# EasyEDA Pro project ST-Link.epro

# Schematic ST-Link_v1_1
Board Name: ST-LINK_v1_1; Create Date: 2025-02-08; Page Name: ST-LINK; Project Name: ST-Link; Schematic Name: ST-LINK_v1_1; Update Date: 2025-02-09
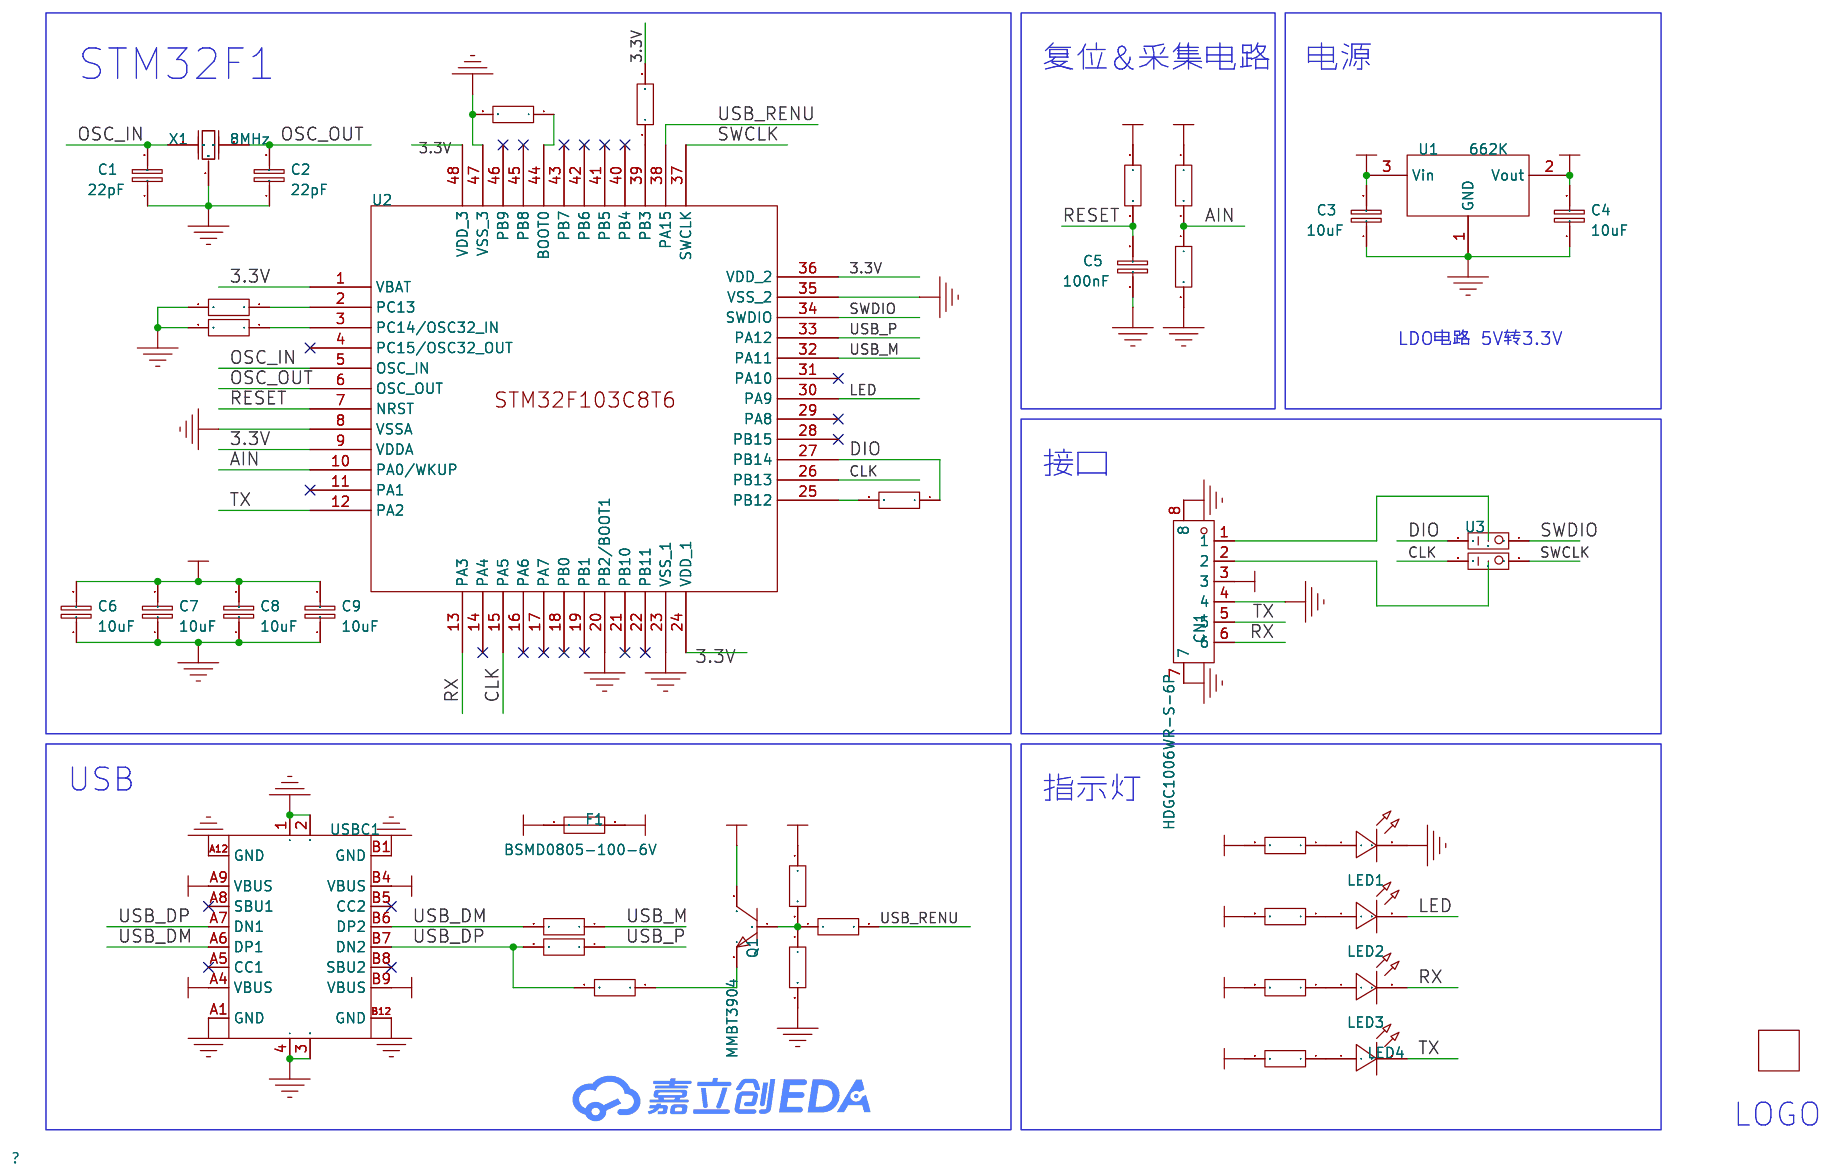
[diagram p0: schematic sheet]

## Parts
C1  22pF  [C0603]
C2  22pF  [C0603]
C3  10uF  [C0603]
C4  10uF  [C0603]
C5  100nF  [C0603]
C6  10uF  [C0603]
C7  10uF  [C0603]
C8  10uF  [C0603]
C9  10uF  [C0603]
CN1  HDGC1006WR-S-6P  [CONN-SMD_6P-P1.00_HDGC1006WR-S-6P]
F1  BSMD0805-100-6V  [F0805]
H1  MoonGrt  [MoonGrt]  (no BOM)
LED1  LTST-C193TBKT-5A  [LED0603]
LED2  LTST-C193TBKT-5A  [LED0603]
LED3  LTST-C193TBKT-5A  [LED0603]
LED4  LTST-C193TBKT-5A  [LED0603]
Q1  MMBT3904  [SOT-23-3_L2.9-W1.3-P1.90-LS2.4-BR]
R1  4.7kΩ  [R0603]
R2  10kΩ  [R0603]
R3  10kΩ  [R0603]
R4  10kΩ  [R0603]
R5  10kΩ  [R0603]
R6  10kΩ  [R0603]
R7  10kΩ  [R0603]
R8  100Ω  [R0603]
R9  1kΩ  [R0603]
R10  10kΩ  [R0603]
R11  22Ω  [R0603]
R12  22Ω  [R0603]
R13  100Ω  [R0603]
R14  1kΩ  [R0603]
R15  36kΩ  [R0603]
R16  1.5kΩ  [R0603]
R17  1kΩ  [R0603]
R18  1kΩ  [R0603]
U1  662K  [SOT-23-3_L2.9-W1.3-P1.90-LS2.4-BR]
U2  STM32F103C8T6  [LQFP-48_L7.0-W7.0-P0.50-LS9.0-BL]
U3  CAS-D20TB1  [SW-SMD_L5.4-W3.9_CAS-D20B]
USBC1  TYPE-C-31-M-12  [USB-C_SMD-TYPE-C-31-M-12]
X1  8MHz  [OSC-SMD_3P-L3.2-W1.3-P1.20-L]

## Library data of the parts
C1 C2 = CL10C220JB8NNNC: 容值:22pF;精度:±5%;额定电压:50V;材质(温度系数):C0G;; LCSC Part Name: 22pF ±5% 50V; Supplier Part: C1653; Manufacturer: SAMSUNG(三星); Supplier Footprint: 0603; JLCPCB Part Class: Basic Part; Datasheet: https://atta.szlcsc.com/upload/public/pdf/source/20160218/1457707763339.pdf; Supplier: LCSC; Tolerance: ±5%; Voltage Rated: 50V; Temperature Coefficient: C0G
C3 C4 C6-C9 = CL10A106KP8NNNC: 容值:10uF;精度:±10%;额定电压:10V;材质(温度系数):X5R;; LCSC Part Name: 10uF ±10% 10V; Supplier Part: C19702; Manufacturer: SAMSUNG(三星); Supplier Footprint: 0603; JLCPCB Part Class: Basic Part; Datasheet: https://atta.szlcsc.com/upload/public/pdf/source/20160218/1457707763339.pdf; Supplier: LCSC; Tolerance: ±10%; Voltage Rated: 10V; Temperature Coefficient: X5R
C5 = CC0603KRX7R9BB104: 容值:100nF;精度:±10%;额定电压:50V;材质(温度系数):X7R;; LCSC Part Name: 100nF ±10% 50V; Supplier Part: C14663; Manufacturer: YAGEO(国巨); Supplier Footprint: 0603; JLCPCB Part Class: Basic Part; Datasheet: https://atta.szlcsc.com/upload/public/pdf/source/20180910/C282072_33301C7F631E79921B82A8DAC6BCC5B3.pdf; Supplier: LCSC; Tolerance: ±10%; Voltage Rated: 50V; Temperature Coefficient: X7R
CN1 = HDGC1006WR-S-6P: 插针结构:1x6P;间距:1mm;安装方式:卧贴;总PIN数:6P;排数:1;每排PIN数:6;额定电流:1A;; LCSC Part Name: 1x6P 间距:1mm 卧贴; Supplier Part: C5197090; Manufacturer: HDGC(华德共创); Supplier Footprint: SMD,P=1mm; JLCPCB Part Class: Extended Part; Datasheet: https://atta.szlcsc.com/upload/public/pdf/source/20221012/30255957866F13431CB1BBD07128FF9E.pdf; Supplier: LCSC; Pins Structure: 1x6P; Pitch: 1mm; Mounting Style: 卧贴; Number of Pins: 6P; Number of Rows: 1; Number of PINs Per Row: 6; Current Rating (Max): 1A
F1 = BSMD0805-100-6V: 最大电压:6V;最大电流:40A;保持电流:1A;跳闸电流:2A;; LCSC Part Name: 6V 1A 0805自恢复; Supplier Part: C883112; Manufacturer: BHFUSE(佰宏); Supplier Footprint: 0805; JLCPCB Part Class: Extended Part; Datasheet: https://atta.szlcsc.com/upload/public/pdf/source/20230512/7A46D6CD923C15CBB98FD769C08EDD80.pdf; Supplier: LCSC; Operating Voltage (Max): 6V; Current Rating (Max): 40A; Hold Current: 1A; Trip Current: 2A; Power Dissipation: 600mW; Resistance - Initial (Ri) (Min): 40mΩ; Resistance - Post Trip (R1) (Max): 270mΩ; Maximum Time to Trip: 300ms; Operating Temperature: -40℃~+85℃
H1 = MoonGrt
LED1-LED4 = LTST-C193TBKT-5A: 发光颜色:蓝色;正向电压(VF):2.8V;功率:76mW;正向电流:5mA;主波长:465nm~475nm;二极管配置:-;透镜颜色:无色透明透镜;色温:-;发光强度:15mcd;发光角度:130°;载带方式:-;工作温度:-20℃~+80℃;; LCSC Part Name: 蓝灯; Supplier Part: C125103; Manufacturer: LITEON(光宝); Supplier Footprint: 0603; JLCPCB Part Class: Extended Part; Datasheet: https://atta.szlcsc.com/upload/public/pdf/source/20171230/C125103_15146280496221222053.pdf; Supplier: LCSC; Emitted Color: 蓝色; Forward Voltage (VF): 2.8V; Power Dissipation: 76mW; Forward Current: 5mA; Dominant Wavelength: 465nm~475nm; Peak Wavelength: 468nm; Lens Color: 无色透明透镜; Luminous Intensity: 15mcd; Viewing Angle: 130°; Operating Temperature: -20℃~+80℃
Q1 = MMBT3904_C7420353: 晶体管类型:NPN;集电极电流(Ic):200mA;集射极击穿电压(Vceo):40V;功率(Pd):200mW;直流电流增益(hFE@Ic,Vce):100@10mA,1.0V;; LCSC Part Name: hFE:200-300，丝印:1AM; Supplier Part: C7420353; Manufacturer: 宏迦橙; Supplier Footprint: SOT-23; JLCPCB Part Class: Extended Part; Datasheet: https://atta.szlcsc.com/upload/public/pdf/source/20231222/9A010B27D82CC750314EB13106235FB7.pdf; Supplier: LCSC; Transistor Type: NPN; Collector Current (Ic): 200mA; Collector-Emitter Breakdown Voltage (Vceo): 40V; Power Dissipation (Pd): 200mW; DC Current Gain (hFE@Ic,Vce): 100@10mA,1.0V; Transition Frequency (fT): 300MHz; Collector Cut-Off Current (Icbo): 100nA; Collector-Emitter Saturation Voltage (VCE(sat)@Ic,Ib): 300mV@50mA,5.0mA; Operating Temperature: -55℃~+150℃
R1 = 0603WAF4701T5E: 电阻类型:厚膜电阻;阻值:4.7kΩ;精度:±1%;功率:100mW;最大工作电压:75V;温度系数:±100ppm/℃;; LCSC Part Name: 4.7kΩ ±1% 100mW 厚膜电阻; Supplier Part: C23162; Manufacturer: UNI-ROYAL(厚声); Supplier Footprint: 0603; JLCPCB Part Class: Basic Part; Datasheet: https://atta.szlcsc.com/upload/public/pdf/source/20200306/C422600_1E6D84923E4A46A82E41ADD87F860B5C.pdf; Supplier: LCSC; Type: 厚膜电阻; Tolerance: ±1%; Power(Watts): 100mW; Overload Voltage (Max): 75V; Temperature Coefficient: ±100ppm/℃; Operating Temperature Range: -55℃~+155℃
R2-R7 R10 = 0603WAF1002T5E: 电阻类型:厚膜电阻;阻值:10kΩ;精度:±1%;功率:100mW;最大工作电压:75V;温度系数:±100ppm/℃;; LCSC Part Name: 厚膜电阻 10kΩ ±1% 100mW; Supplier Part: C25804; Manufacturer: UNI-ROYAL(厚声); Supplier Footprint: 0603; JLCPCB Part Class: Basic Part; Datasheet: https://atta.szlcsc.com/upload/public/pdf/source/20200306/C422600_1E6D84923E4A46A82E41ADD87F860B5C.pdf; Supplier: LCSC; Type: 厚膜电阻; Tolerance: ±1%; Power(Watts): 100mW; Overload Voltage (Max): 75V; Temperature Coefficient: ±100ppm/℃; Operating Temperature Range: -55℃~+155℃
R8 R13 = 0603WAF1000T5E: 电阻类型:厚膜电阻;阻值:100Ω;精度:±1%;功率:100mW;最大工作电压:75V;温度系数:±200ppm/℃;; LCSC Part Name: 100Ω ±1% 100mW 厚膜电阻; Supplier Part: C22775; Manufacturer: UNI-ROYAL(厚声); Supplier Footprint: 0603; JLCPCB Part Class: Basic Part; Datasheet: https://atta.szlcsc.com/upload/public/pdf/source/20200306/C422600_1E6D84923E4A46A82E41ADD87F860B5C.pdf; Supplier: LCSC; Type: 厚膜电阻; Tolerance: ±1%; Power(Watts): 100mW; Overload Voltage (Max): 75V; Temperature Coefficient: ±200ppm/℃; Operating Temperature Range: -55℃~+155℃
R9 R14 R17 R18 = 0603WAF1001T5E: 电阻类型:厚膜电阻;阻值:1kΩ;精度:±1%;功率:100mW;最大工作电压:75V;温度系数:±100ppm/℃;; LCSC Part Name: 1kΩ ±1% 100mW 厚膜电阻; Supplier Part: C21190; Manufacturer: UNI-ROYAL(厚声); Supplier Footprint: 0603; JLCPCB Part Class: Basic Part; Datasheet: https://atta.szlcsc.com/upload/public/pdf/source/20200306/C422600_1E6D84923E4A46A82E41ADD87F860B5C.pdf; Supplier: LCSC; Type: 厚膜电阻; Tolerance: ±1%; Power(Watts): 100mW; Overload Voltage (Max): 75V; Temperature Coefficient: ±100ppm/℃; Operating Temperature Range: -55℃~+155℃
R11 R12 = 0603WAF220JT5E: 电阻类型:厚膜电阻;阻值:22Ω;精度:±1%;功率:100mW;最大工作电压:75V;温度系数:±100ppm/℃;; LCSC Part Name: 22Ω ±1% 100mW 厚膜电阻; Supplier Part: C23345; Manufacturer: UNI-ROYAL(厚声); Supplier Footprint: 0603; JLCPCB Part Class: Basic Part; Datasheet: https://atta.szlcsc.com/upload/public/pdf/source/20200306/C422600_1E6D84923E4A46A82E41ADD87F860B5C.pdf; Supplier: LCSC; Type: 厚膜电阻; Tolerance: ±1%; Power(Watts): 100mW; Overload Voltage (Max): 75V; Temperature Coefficient: ±100ppm/℃; Operating Temperature Range: -55℃~+155℃
R15 = 0603WAF3602T5E: 电阻类型:厚膜电阻;阻值:36kΩ;精度:±1%;功率:100mW;最大工作电压:75V;温度系数:±100ppm/℃;; LCSC Part Name: 36kΩ ±1% 100mW 厚膜电阻; Supplier Part: C23147; Manufacturer: UNI-ROYAL(厚声); Supplier Footprint: 0603; JLCPCB Part Class: Extended Part; Datasheet: https://atta.szlcsc.com/upload/public/pdf/source/20200306/C422600_1E6D84923E4A46A82E41ADD87F860B5C.pdf; Supplier: LCSC; Type: 厚膜电阻; Tolerance: ±1%; Power(Watts): 100mW; Overload Voltage (Max): 75V; Temperature Coefficient: ±100ppm/℃; Operating Temperature Range: -55℃~+155℃
R16 = 0603WAF1501T5E: 电阻类型:厚膜电阻;阻值:1.5kΩ;精度:±1%;功率:100mW;最大工作电压:75V;温度系数:±100ppm/℃;; LCSC Part Name: 1.5kΩ ±1% 100mW 厚膜电阻; Supplier Part: C22843; Manufacturer: UNI-ROYAL(厚声); Supplier Footprint: 0603; JLCPCB Part Class: Basic Part; Datasheet: https://atta.szlcsc.com/upload/public/pdf/source/20200306/C422600_1E6D84923E4A46A82E41ADD87F860B5C.pdf; Supplier: LCSC; Type: 厚膜电阻; Tolerance: ±1%; Power(Watts): 100mW; Overload Voltage (Max): 75V; Temperature Coefficient: ±100ppm/℃; Operating Temperature Range: -55℃~+155℃
U1 = 662K: 输出类型:固定;最大输入电压:8V;输出电压:3.3V;最大输出电流:300mA;输出极性:正极;; LCSC Part Name: 662K. 输入8V 300mA; Supplier Part: C7470756; Manufacturer: HXY MOSFET(华轩阳电子); Supplier Footprint: SOT-23; JLCPCB Part Class: Extended Part; Datasheet: https://atta.szlcsc.com/upload/public/pdf/source/20230915/BA72989D17401E2852D389BF12EDF43F.pdf; Supplier: LCSC; Output Type: 固定; Maximum Input Voltage: 8V; Output Voltage: 3.3V; MAX Output Current: 300mA; Output Polarity: 正极; Number of Outputs: 1; Design Item ID: LM317; Library Name: fly
U2 = STM32F103C8T6: CPU内核:ARM-M3;CPU最大主频:72MHz;应用领域:-;; LCSC Part Name: 主流增强型ARM Cortex-M3 MCU，具有64 KB Flash、72 MHz CPU、电机控制、USB和CAN; Supplier Part: C8734; Manufacturer: ST(意法半导体); Supplier Footprint: LQFP-48(7x7); JLCPCB Part Class: Extended Part; Datasheet: https://atta.szlcsc.com/upload/public/pdf/source/20220812/8363ACEC51AD55ECEB84799464F7CB85.pdf; Supplier: LCSC; CPU Core: ARM-M3; CPU Maximum Speed: 72MHz; Program Storage Size: 64KB; Program Memory Type: FLASH; Number of I/O: 37; ADC (Bit): 12bit; Low Voltage Detection Threshold: 2V~3.6V
U3 = CAS-D20TB1: 电路结构:单刀双掷;安装方式:立贴;开关颜色:白色;额定电流(DC):100mA;额定电压(DC):50V;机械寿命:-;; LCSC Part Name: 立贴两档 滑动开关; Supplier Part: C2921545; Manufacturer: NIDEC(尼得科); Supplier Footprint: SMD; JLCPCB Part Class: 扩展库; Datasheet: https://atta.szlcsc.com/upload/public/pdf/source/20220330/71F3735FCF2D747C582FB0D70EB9BF68.pdf; Supplier: LCSC; Circuit: 单刀双掷; Pin Style: 鸥翼型; Switch Length: 5.4mm; Switch Width: 3.9mm; Switch Height: 2.5mm; Mounting Style: 立贴; Actuator Color: 白色; Current Rating (DC): 100mA; Voltage Rating (DC): 50V; Operating Temperature: -40℃~+85℃
USBC1 = TYPE-C-31-M-12: 连接器类型:Type-C;标准:-;公母:母;安装方式:-;触点数量:16P;端口数量:1;额定电流 - 电源:5A;工作温度范围:-;; LCSC Part Name: Type-C 母; Supplier Part: C165948; Manufacturer: 韩国韩荣; Supplier Footprint: SMD; JLCPCB Part Class: Extended Part; Datasheet: https://atta.szlcsc.com/upload/public/pdf/source/20220525/466408E853115E789EDB0DDC29077C05.pdf; Supplier: LCSC; Connector Type: Type-C; Gender: 母; Number of Contacts: 16P; Number of Ports: 1; Current Rating - Power (Max): 5A
X1 = CSTNE8M00GH5C000R0: 频率:8MHz;内置负载电容:33pF;谐振阻抗:40Ω;; LCSC Part Name: 8MHz ±0.07% 内置负载电容:33pF; Supplier Part: C341525; Manufacturer: muRata(村田); Supplier Footprint: SMD3213-3P; JLCPCB Part Class: Extended Part; Datasheet: https://atta.szlcsc.com/upload/public/pdf/source/20181211/C341525_832BA077079E4863A5153C1DB98581D5.pdf; Supplier: LCSC; Built-in Load Capacitance: 33pF; Resonant Impedance: 40Ω; Operating Temperature: -40℃~+125℃

## Nets
3.3V: C4.2 C6.2 C7.2 C8.2 C9.2 CN1.3 Q1.3(C) R1.2 R3.1 R4.1 R9.2 R14.2 R17.2 R18.2 U1.2(Vout) U2.1(VBAT) U2.9(VDDA) U2.24(VDD_1) U2.36(VDD_2) U2.48(VDD_3)
5V: C3.2 F1.2 R10.1 U1.3(Vin)
GND: C1.1 C2.1 C3.1 C4.1 C5.1 C6.1 C7.1 C8.1 C9.1 CN1.4 CN1.7 CN1.8 LED1.2 R2.2 R5.2 R6.2 R7.2 R15.2 U1.1(GND) U2.8(VSSA) U2.20(PB2/BOOT1) U2.23(VSS_1) U2.35(VSS_2) U2.47(VSS_3) USBC1.1 USBC1.2 USBC1.3 USBC1.4 USBC1.A1(GND) USBC1.A12(GND) USBC1.B1(GND) USBC1.B12(GND) X1.2(GND)
VBUS: F1.1 USBC1.A4(VBUS) USBC1.A9(VBUS) USBC1.B4(VBUS) USBC1.B9(VBUS)
AIN: R4.2 R5.1 U2.10(PA0/WKUP)
CLK: U2.15(PA5) U2.26(PB13) U3.3
DIO: R8.1 U2.27(PB14) U3.6
LED: LED2.2 U2.30(PA9)
OSC_IN: C1.2 U2.5(OSC_IN) X1.3(OSC2)
OSC_OUT: C2.2 U2.6(OSC_OUT) X1.1(OSC1)
RESET: C5.2 R3.2 U2.7(NRST)
RX: CN1.6 LED3.2 U2.13(PA3)
SWCLK: U2.37(SWCLK) U3.1
SWDIO: U2.34(SWDIO) U3.4
TX: CN1.5 LED4.2 U2.12(PA2)
USB_DM: R11.2 USBC1.A6(DP1) USBC1.B6(DP2)
USB_DP: R12.2 R16.2 USBC1.A7(DN1) USBC1.B7(DN2)
USB_M: R11.1 U2.32(PA11)
USB_P: R12.1 U2.33(PA12)
USB_RENU: R13.2 U2.38(PA15)
$2N32655: R6.1 U2.2(PC13)
$2N32685: Q1.2(E) R16.1
$2N32778: R8.2 U2.25(PB12)
$2N32789: CN1.2 U3.2
$2N32791: CN1.1 U3.5
$2N32800: R2.1 U2.44(BOOT0)
$2N32802: R1.1 U2.39(PB3)
$2N32803: R7.1 U2.3(PC14/OSC32_IN)
$2N32831: Q1.1(B) R10.2 R13.1 R15.1
$2N38015: LED1.1 R9.1
$2N38044: LED2.1 R14.1
$2N38073: LED3.1 R17.1
$2N38102: LED4.1 R18.1

Not connected (* = marked no-connect by the designer): U2 4(PC15/OSC32_OUT)* 11(PA1)* 14(PA4)* 16(PA6)* 17(PA7)* 18(PB0)* 19(PB1)* 21(PB10)* 22(PB11)* 28(PB15)* 29(PA8)* 31(PA10)* 40(PB4)* 41(PB5)* 42(PB6)* 43(PB7)* 45(PB8)* 46(PB9)*; USBC1 A5(CC1)* A8(SBU1)* B5(CC2)* B8(SBU2)*

## Notes on the sheet
- STM32F1
- 复位&采集电路
- 电源
- LDO电路 5V转3.3V
- 接口
- USB
- 指示灯
- LOGO

# Schematic ST-Link_v1_2
Board Name: ST-Link_v1_2; Create Date: 2025-02-18; Page Name: ST-Link; Project Name: ST-Link; Schematic Name: ST-Link_1; Update Date: 2025-02-18
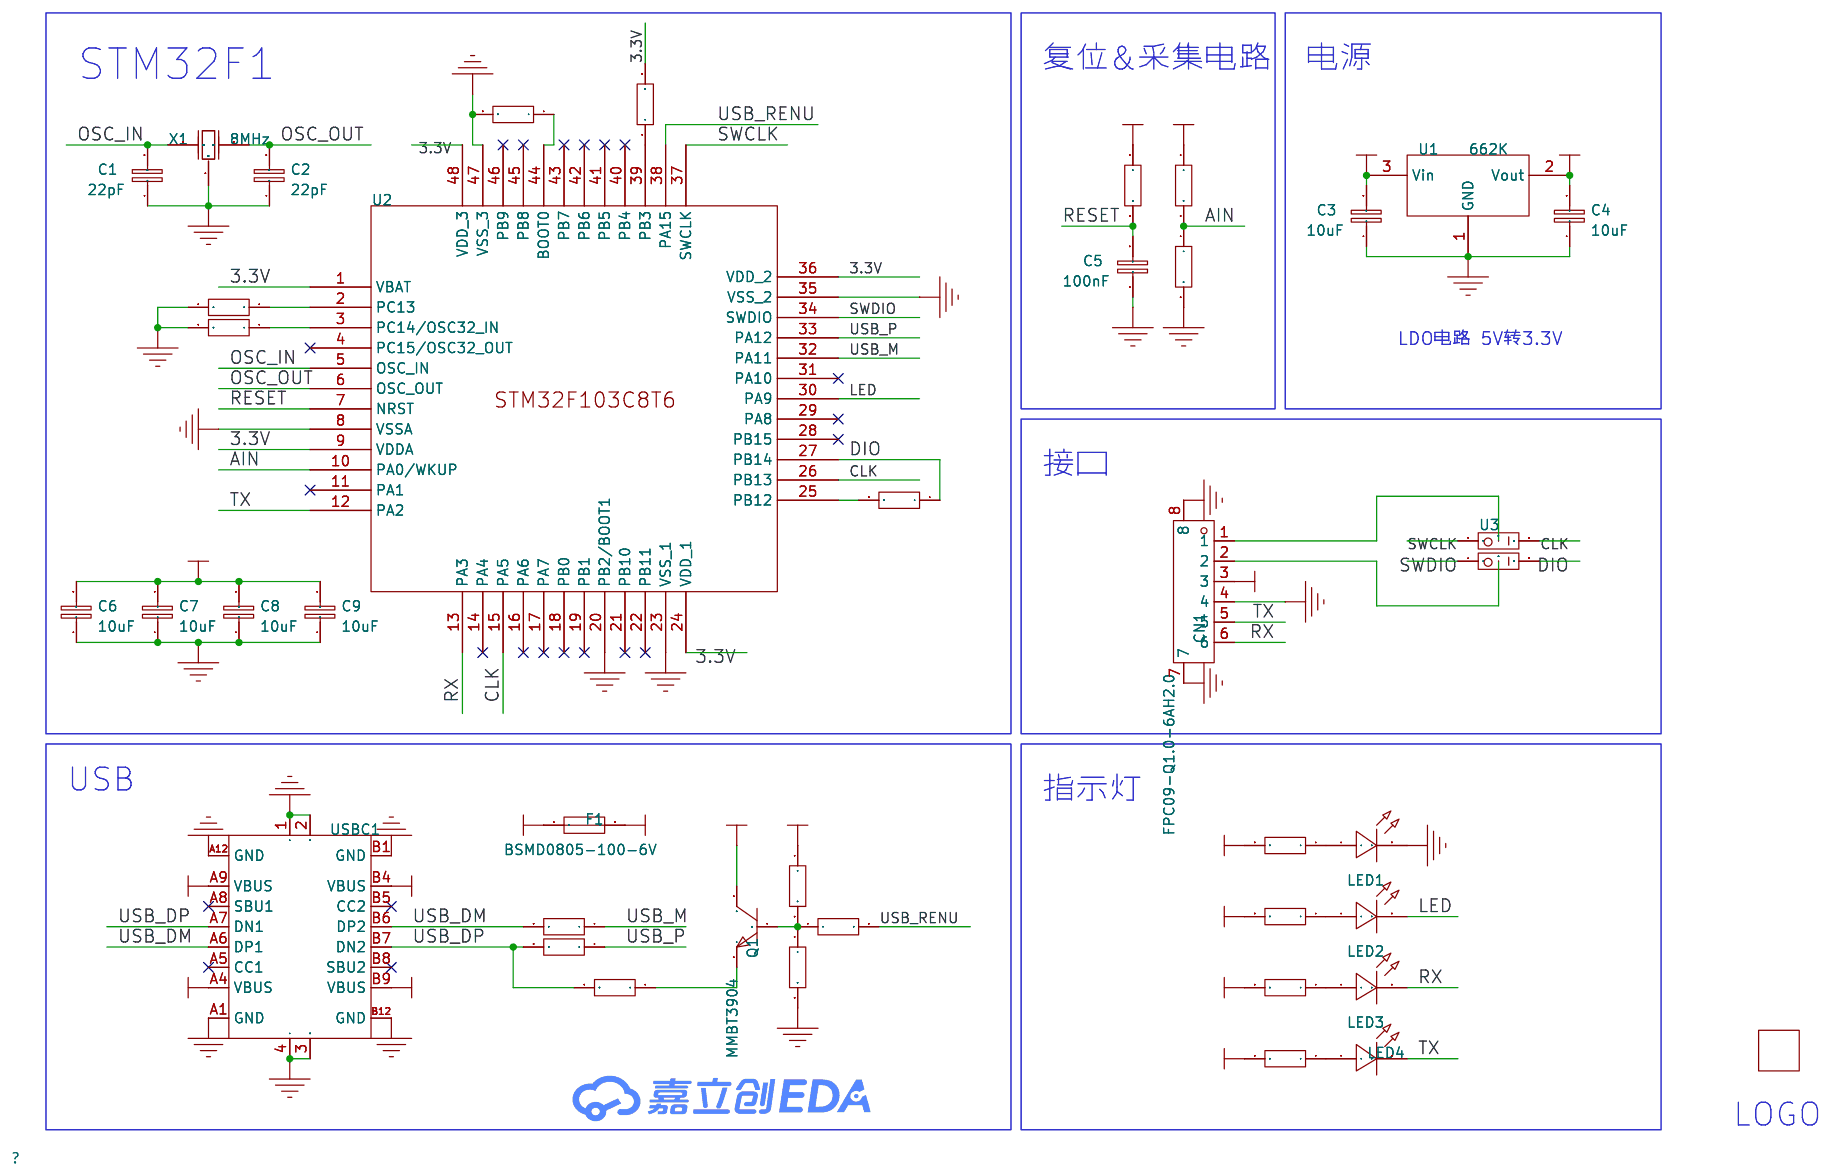
[diagram p1: schematic sheet]

## Parts
C1  22pF  [C0603]
C2  22pF  [C0603]
C3  10uF  [C0603]
C4  10uF  [C0603]
C5  100nF  [C0603]
C6  10uF  [C0603]
C7  10uF  [C0603]
C8  10uF  [C0603]
C9  10uF  [C0603]
CN1  FPC09-Q1.0-6AH2.0  [FPC-SMD_6P-P1.00_XYECONN_FPC09-Q1.0-6AH2.0]
F1  BSMD0805-100-6V  [F0805]
H1  MoonGrt  [MoonGrt]  (no BOM)
LED1  LTST-C193TBKT-5A  [LED0603]
LED2  LTST-C193TBKT-5A  [LED0603]
LED3  LTST-C193TBKT-5A  [LED0603]
LED4  LTST-C193TBKT-5A  [LED0603]
Q1  MMBT3904  [SOT-23-3_L2.9-W1.3-P1.90-LS2.4-BR]
R1  4.7kΩ  [R0603]
R2  10kΩ  [R0603]
R3  10kΩ  [R0603]
R4  10kΩ  [R0603]
R5  10kΩ  [R0603]
R6  10kΩ  [R0603]
R7  10kΩ  [R0603]
R8  100Ω  [R0603]
R9  1kΩ  [R0603]
R10  10kΩ  [R0603]
R11  22Ω  [R0603]
R12  22Ω  [R0603]
R13  100Ω  [R0603]
R14  1kΩ  [R0603]
R15  36kΩ  [R0603]
R16  1.5kΩ  [R0603]
R17  1kΩ  [R0603]
R18  1kΩ  [R0603]
U1  662K  [SOT-23-3_L2.9-W1.3-P1.90-LS2.4-BR]
U2  STM32F103C8T6  [LQFP-48_L7.0-W7.0-P0.50-LS9.0-BL]
U3  CAS-D20TB1  [SW-SMD_L5.4-W3.9_CAS-D20B]
USBC1  TYPE-C-31-M-12  [USB-C_SMD-TYPE-C-31-M-12]
X1  8MHz  [OSC-SMD_3P-L3.2-W1.3-P1.20-L]

## Library data of the parts
C1 C2 = CL10C220JB8NNNC: 容值:22pF;精度:±5%;额定电压:50V;材质(温度系数):C0G;; LCSC Part Name: 22pF ±5% 50V; Supplier Part: C1653; Manufacturer: SAMSUNG(三星); Supplier Footprint: 0603; JLCPCB Part Class: Basic Part; Datasheet: https://atta.szlcsc.com/upload/public/pdf/source/20160218/1457707763339.pdf; Supplier: LCSC; Tolerance: ±5%; Voltage Rated: 50V; Temperature Coefficient: C0G
C3 C4 C6-C9 = CL10A106KP8NNNC: 容值:10uF;精度:±10%;额定电压:10V;材质(温度系数):X5R;; LCSC Part Name: 10uF ±10% 10V; Supplier Part: C19702; Manufacturer: SAMSUNG(三星); Supplier Footprint: 0603; JLCPCB Part Class: Basic Part; Datasheet: https://atta.szlcsc.com/upload/public/pdf/source/20160218/1457707763339.pdf; Supplier: LCSC; Tolerance: ±10%; Voltage Rated: 10V; Temperature Coefficient: X5R
C5 = CC0603KRX7R9BB104: 容值:100nF;精度:±10%;额定电压:50V;材质(温度系数):X7R;; LCSC Part Name: 100nF ±10% 50V; Supplier Part: C14663; Manufacturer: YAGEO(国巨); Supplier Footprint: 0603; JLCPCB Part Class: Basic Part; Datasheet: https://atta.szlcsc.com/upload/public/pdf/source/20180910/C282072_33301C7F631E79921B82A8DAC6BCC5B3.pdf; Supplier: LCSC; Tolerance: ±10%; Voltage Rated: 50V; Temperature Coefficient: X7R
CN1 = FPC09-Q1.0-6AH2.0: 锁定特性:翻盖式;触点类型:下接;触点数量:6P;间距:1mm;安装类型:卧贴;; LCSC Part Name: 间距:1mm P数:6P 翻盖式 下接; Supplier Part: C19269921; Manufacturer: XYECONN(辛译); Supplier Footprint: SMD,P=1mm,卧贴; JLCPCB Part Class: Extended Part; Datasheet: https://atta.szlcsc.com/upload/public/pdf/source/20231122/290E50ABEF878A57FE1C34FD27D651A8.pdf; Supplier: LCSC; Locking Feature: 翻盖式; Contact Type: 下接; Number of Contacts: 6P; Pitch: 1mm; Mounting Type: 卧贴; Height Above Board: 2mm
F1 = BSMD0805-100-6V: 最大电压:6V;最大电流:40A;保持电流:1A;跳闸电流:2A;; LCSC Part Name: 6V 1A 0805自恢复; Supplier Part: C883112; Manufacturer: BHFUSE(佰宏); Supplier Footprint: 0805; JLCPCB Part Class: Extended Part; Datasheet: https://atta.szlcsc.com/upload/public/pdf/source/20230512/7A46D6CD923C15CBB98FD769C08EDD80.pdf; Supplier: LCSC; Operating Voltage (Max): 6V; Current Rating (Max): 40A; Hold Current: 1A; Trip Current: 2A; Power Dissipation: 600mW; Resistance - Initial (Ri) (Min): 40mΩ; Resistance - Post Trip (R1) (Max): 270mΩ; Maximum Time to Trip: 300ms; Operating Temperature: -40℃~+85℃
H1 = MoonGrt
LED1-LED4 = LTST-C193TBKT-5A: 发光颜色:蓝色;正向电压(VF):2.8V;功率:76mW;正向电流:5mA;主波长:465nm~475nm;二极管配置:-;透镜颜色:无色透明透镜;色温:-;发光强度:15mcd;发光角度:130°;载带方式:-;工作温度:-20℃~+80℃;; LCSC Part Name: 蓝灯; Supplier Part: C125103; Manufacturer: LITEON(光宝); Supplier Footprint: 0603; JLCPCB Part Class: Extended Part; Datasheet: https://atta.szlcsc.com/upload/public/pdf/source/20171230/C125103_15146280496221222053.pdf; Supplier: LCSC; Emitted Color: 蓝色; Forward Voltage (VF): 2.8V; Power Dissipation: 76mW; Forward Current: 5mA; Dominant Wavelength: 465nm~475nm; Peak Wavelength: 468nm; Lens Color: 无色透明透镜; Luminous Intensity: 15mcd; Viewing Angle: 130°; Operating Temperature: -20℃~+80℃
Q1 = MMBT3904_C7420353: 晶体管类型:NPN;集电极电流(Ic):200mA;集射极击穿电压(Vceo):40V;功率(Pd):200mW;直流电流增益(hFE@Ic,Vce):100@10mA,1.0V;; LCSC Part Name: hFE:200-300，丝印:1AM; Supplier Part: C7420353; Manufacturer: 宏迦橙; Supplier Footprint: SOT-23; JLCPCB Part Class: Extended Part; Datasheet: https://atta.szlcsc.com/upload/public/pdf/source/20231222/9A010B27D82CC750314EB13106235FB7.pdf; Supplier: LCSC; Transistor Type: NPN; Collector Current (Ic): 200mA; Collector-Emitter Breakdown Voltage (Vceo): 40V; Power Dissipation (Pd): 200mW; DC Current Gain (hFE@Ic,Vce): 100@10mA,1.0V; Transition Frequency (fT): 300MHz; Collector Cut-Off Current (Icbo): 100nA; Collector-Emitter Saturation Voltage (VCE(sat)@Ic,Ib): 300mV@50mA,5.0mA; Operating Temperature: -55℃~+150℃
R1 = 0603WAF4701T5E: 电阻类型:厚膜电阻;阻值:4.7kΩ;精度:±1%;功率:100mW;最大工作电压:75V;温度系数:±100ppm/℃;; LCSC Part Name: 4.7kΩ ±1% 100mW 厚膜电阻; Supplier Part: C23162; Manufacturer: UNI-ROYAL(厚声); Supplier Footprint: 0603; JLCPCB Part Class: Basic Part; Datasheet: https://atta.szlcsc.com/upload/public/pdf/source/20200306/C422600_1E6D84923E4A46A82E41ADD87F860B5C.pdf; Supplier: LCSC; Type: 厚膜电阻; Tolerance: ±1%; Power(Watts): 100mW; Overload Voltage (Max): 75V; Temperature Coefficient: ±100ppm/℃; Operating Temperature Range: -55℃~+155℃
R2-R7 R10 = 0603WAF1002T5E: 电阻类型:厚膜电阻;阻值:10kΩ;精度:±1%;功率:100mW;最大工作电压:75V;温度系数:±100ppm/℃;; LCSC Part Name: 厚膜电阻 10kΩ ±1% 100mW; Supplier Part: C25804; Manufacturer: UNI-ROYAL(厚声); Supplier Footprint: 0603; JLCPCB Part Class: Basic Part; Datasheet: https://atta.szlcsc.com/upload/public/pdf/source/20200306/C422600_1E6D84923E4A46A82E41ADD87F860B5C.pdf; Supplier: LCSC; Type: 厚膜电阻; Tolerance: ±1%; Power(Watts): 100mW; Overload Voltage (Max): 75V; Temperature Coefficient: ±100ppm/℃; Operating Temperature Range: -55℃~+155℃
R8 R13 = 0603WAF1000T5E: 电阻类型:厚膜电阻;阻值:100Ω;精度:±1%;功率:100mW;最大工作电压:75V;温度系数:±200ppm/℃;; LCSC Part Name: 100Ω ±1% 100mW 厚膜电阻; Supplier Part: C22775; Manufacturer: UNI-ROYAL(厚声); Supplier Footprint: 0603; JLCPCB Part Class: Basic Part; Datasheet: https://atta.szlcsc.com/upload/public/pdf/source/20200306/C422600_1E6D84923E4A46A82E41ADD87F860B5C.pdf; Supplier: LCSC; Type: 厚膜电阻; Tolerance: ±1%; Power(Watts): 100mW; Overload Voltage (Max): 75V; Temperature Coefficient: ±200ppm/℃; Operating Temperature Range: -55℃~+155℃
R9 R14 R17 R18 = 0603WAF1001T5E: 电阻类型:厚膜电阻;阻值:1kΩ;精度:±1%;功率:100mW;最大工作电压:75V;温度系数:±100ppm/℃;; LCSC Part Name: 1kΩ ±1% 100mW 厚膜电阻; Supplier Part: C21190; Manufacturer: UNI-ROYAL(厚声); Supplier Footprint: 0603; JLCPCB Part Class: Basic Part; Datasheet: https://atta.szlcsc.com/upload/public/pdf/source/20200306/C422600_1E6D84923E4A46A82E41ADD87F860B5C.pdf; Supplier: LCSC; Type: 厚膜电阻; Tolerance: ±1%; Power(Watts): 100mW; Overload Voltage (Max): 75V; Temperature Coefficient: ±100ppm/℃; Operating Temperature Range: -55℃~+155℃
R11 R12 = 0603WAF220JT5E: 电阻类型:厚膜电阻;阻值:22Ω;精度:±1%;功率:100mW;最大工作电压:75V;温度系数:±100ppm/℃;; LCSC Part Name: 22Ω ±1% 100mW 厚膜电阻; Supplier Part: C23345; Manufacturer: UNI-ROYAL(厚声); Supplier Footprint: 0603; JLCPCB Part Class: Basic Part; Datasheet: https://atta.szlcsc.com/upload/public/pdf/source/20200306/C422600_1E6D84923E4A46A82E41ADD87F860B5C.pdf; Supplier: LCSC; Type: 厚膜电阻; Tolerance: ±1%; Power(Watts): 100mW; Overload Voltage (Max): 75V; Temperature Coefficient: ±100ppm/℃; Operating Temperature Range: -55℃~+155℃
R15 = 0603WAF3602T5E: 电阻类型:厚膜电阻;阻值:36kΩ;精度:±1%;功率:100mW;最大工作电压:75V;温度系数:±100ppm/℃;; LCSC Part Name: 36kΩ ±1% 100mW 厚膜电阻; Supplier Part: C23147; Manufacturer: UNI-ROYAL(厚声); Supplier Footprint: 0603; JLCPCB Part Class: Extended Part; Datasheet: https://atta.szlcsc.com/upload/public/pdf/source/20200306/C422600_1E6D84923E4A46A82E41ADD87F860B5C.pdf; Supplier: LCSC; Type: 厚膜电阻; Tolerance: ±1%; Power(Watts): 100mW; Overload Voltage (Max): 75V; Temperature Coefficient: ±100ppm/℃; Operating Temperature Range: -55℃~+155℃
R16 = 0603WAF1501T5E: 电阻类型:厚膜电阻;阻值:1.5kΩ;精度:±1%;功率:100mW;最大工作电压:75V;温度系数:±100ppm/℃;; LCSC Part Name: 1.5kΩ ±1% 100mW 厚膜电阻; Supplier Part: C22843; Manufacturer: UNI-ROYAL(厚声); Supplier Footprint: 0603; JLCPCB Part Class: Basic Part; Datasheet: https://atta.szlcsc.com/upload/public/pdf/source/20200306/C422600_1E6D84923E4A46A82E41ADD87F860B5C.pdf; Supplier: LCSC; Type: 厚膜电阻; Tolerance: ±1%; Power(Watts): 100mW; Overload Voltage (Max): 75V; Temperature Coefficient: ±100ppm/℃; Operating Temperature Range: -55℃~+155℃
U1 = 662K: 输出类型:固定;最大输入电压:8V;输出电压:3.3V;最大输出电流:300mA;输出极性:正极;; LCSC Part Name: 662K. 输入8V 300mA; Supplier Part: C7470756; Manufacturer: HXY MOSFET(华轩阳电子); Supplier Footprint: SOT-23; JLCPCB Part Class: Extended Part; Datasheet: https://atta.szlcsc.com/upload/public/pdf/source/20230915/BA72989D17401E2852D389BF12EDF43F.pdf; Supplier: LCSC; Output Type: 固定; Maximum Input Voltage: 8V; Output Voltage: 3.3V; MAX Output Current: 300mA; Output Polarity: 正极; Number of Outputs: 1; Design Item ID: LM317; Library Name: fly
U2 = STM32F103C8T6: CPU内核:ARM-M3;CPU最大主频:72MHz;应用领域:-;; LCSC Part Name: 主流增强型ARM Cortex-M3 MCU，具有64 KB Flash、72 MHz CPU、电机控制、USB和CAN; Supplier Part: C8734; Manufacturer: ST(意法半导体); Supplier Footprint: LQFP-48(7x7); JLCPCB Part Class: Extended Part; Datasheet: https://atta.szlcsc.com/upload/public/pdf/source/20220812/8363ACEC51AD55ECEB84799464F7CB85.pdf; Supplier: LCSC; CPU Core: ARM-M3; CPU Maximum Speed: 72MHz; Program Storage Size: 64KB; Program Memory Type: FLASH; Number of I/O: 37; ADC (Bit): 12bit; Low Voltage Detection Threshold: 2V~3.6V
U3 = CAS-D20TB1: 电路结构:单刀双掷;安装方式:立贴;开关颜色:白色;额定电流(DC):100mA;额定电压(DC):50V;机械寿命:-;; LCSC Part Name: 立贴两档 滑动开关; Supplier Part: C2921545; Manufacturer: NIDEC(尼得科); Supplier Footprint: SMD; JLCPCB Part Class: 扩展库; Datasheet: https://atta.szlcsc.com/upload/public/pdf/source/20220330/71F3735FCF2D747C582FB0D70EB9BF68.pdf; Supplier: LCSC; Circuit: 单刀双掷; Pin Style: 鸥翼型; Switch Length: 5.4mm; Switch Width: 3.9mm; Switch Height: 2.5mm; Mounting Style: 立贴; Actuator Color: 白色; Current Rating (DC): 100mA; Voltage Rating (DC): 50V; Operating Temperature: -40℃~+85℃
USBC1 = TYPE-C-31-M-12: 连接器类型:Type-C;标准:-;公母:母;安装方式:-;触点数量:16P;端口数量:1;额定电流 - 电源:5A;工作温度范围:-;; LCSC Part Name: Type-C 母; Supplier Part: C165948; Manufacturer: 韩国韩荣; Supplier Footprint: SMD; JLCPCB Part Class: Extended Part; Datasheet: https://atta.szlcsc.com/upload/public/pdf/source/20220525/466408E853115E789EDB0DDC29077C05.pdf; Supplier: LCSC; Connector Type: Type-C; Gender: 母; Number of Contacts: 16P; Number of Ports: 1; Current Rating - Power (Max): 5A
X1 = CSTNE8M00GH5C000R0: 频率:8MHz;内置负载电容:33pF;谐振阻抗:40Ω;; LCSC Part Name: 8MHz ±0.07% 内置负载电容:33pF; Supplier Part: C341525; Manufacturer: muRata(村田); Supplier Footprint: SMD3213-3P; JLCPCB Part Class: Extended Part; Datasheet: https://atta.szlcsc.com/upload/public/pdf/source/20181211/C341525_832BA077079E4863A5153C1DB98581D5.pdf; Supplier: LCSC; Built-in Load Capacitance: 33pF; Resonant Impedance: 40Ω; Operating Temperature: -40℃~+125℃

## Nets
3.3V: C4.2 C6.2 C7.2 C8.2 C9.2 CN1.3 Q1.3(C) R1.2 R3.1 R4.1 R9.2 R14.2 R17.2 R18.2 U1.2(Vout) U2.1(VBAT) U2.9(VDDA) U2.24(VDD_1) U2.36(VDD_2) U2.48(VDD_3)
5V: C3.2 F1.2 R10.1 U1.3(Vin)
GND: C1.1 C2.1 C3.1 C4.1 C5.1 C6.1 C7.1 C8.1 C9.1 CN1.4 CN1.7 CN1.8 LED1.2 R2.2 R5.2 R6.2 R7.2 R15.2 U1.1(GND) U2.8(VSSA) U2.20(PB2/BOOT1) U2.23(VSS_1) U2.35(VSS_2) U2.47(VSS_3) USBC1.1 USBC1.2 USBC1.3 USBC1.4 USBC1.A1(GND) USBC1.A12(GND) USBC1.B1(GND) USBC1.B12(GND) X1.2(GND)
VBUS: F1.1 USBC1.A4(VBUS) USBC1.A9(VBUS) USBC1.B4(VBUS) USBC1.B9(VBUS)
AIN: R4.2 R5.1 U2.10(PA0/WKUP)
CLK: U2.15(PA5) U2.26(PB13) U3.3
DIO: R8.1 U2.27(PB14) U3.6
LED: LED2.2 U2.30(PA9)
OSC_IN: C1.2 U2.5(OSC_IN) X1.3(OSC2)
OSC_OUT: C2.2 U2.6(OSC_OUT) X1.1(OSC1)
RESET: C5.2 R3.2 U2.7(NRST)
RX: CN1.6 LED3.2 U2.13(PA3)
SWCLK: U2.37(SWCLK) U3.1
SWDIO: U2.34(SWDIO) U3.4
TX: CN1.5 LED4.2 U2.12(PA2)
USB_DM: R11.2 USBC1.A6(DP1) USBC1.B6(DP2)
USB_DP: R12.2 R16.2 USBC1.A7(DN1) USBC1.B7(DN2)
USB_M: R11.1 U2.32(PA11)
USB_P: R12.1 U2.33(PA12)
USB_RENU: R13.2 U2.38(PA15)
$2N32655: R6.1 U2.2(PC13)
$2N32685: Q1.2(E) R16.1
$2N32778: R8.2 U2.25(PB12)
$2N32789: CN1.2 U3.5
$2N32791: CN1.1 U3.2
$2N32800: R2.1 U2.44(BOOT0)
$2N32802: R1.1 U2.39(PB3)
$2N32803: R7.1 U2.3(PC14/OSC32_IN)
$2N32831: Q1.1(B) R10.2 R13.1 R15.1
$2N38015: LED1.1 R9.1
$2N38044: LED2.1 R14.1
$2N38073: LED3.1 R17.1
$2N38102: LED4.1 R18.1

Not connected (* = marked no-connect by the designer): U2 4(PC15/OSC32_OUT)* 11(PA1)* 14(PA4)* 16(PA6)* 17(PA7)* 18(PB0)* 19(PB1)* 21(PB10)* 22(PB11)* 28(PB15)* 29(PA8)* 31(PA10)* 40(PB4)* 41(PB5)* 42(PB6)* 43(PB7)* 45(PB8)* 46(PB9)*; USBC1 A5(CC1)* A8(SBU1)* B5(CC2)* B8(SBU2)*

## Notes on the sheet
- STM32F1
- 复位&采集电路
- 电源
- LDO电路 5V转3.3V
- 接口
- USB
- 指示灯
- LOGO

# Board ST-Link_v1_1
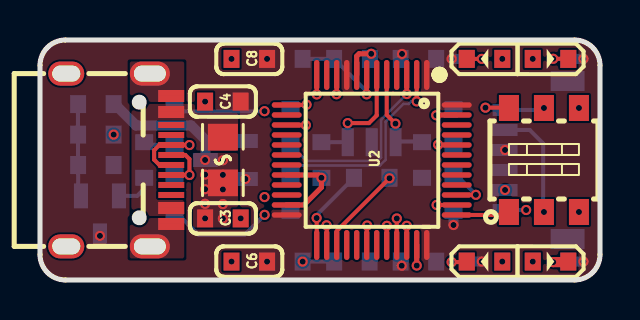
[diagram p2: board, top side]
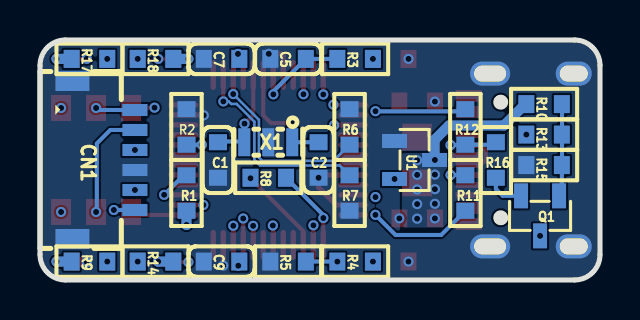
[diagram p3: board, bottom side, seen from below]

Outline 28 x 12 mm; copper layers: Top Layer, Inner1, Inner2, Bottom Layer. Coordinates in mm from the lower left corner of the outline.
Outline path: 0,10.73 0,1.27 arc(0.37,0.37) 1.27,0 26.73,0 arc(27.63,0.37) 28,1.27 28,10.73 arc(27.63,11.63) 26.73,12 1.27,12 arc(0.37,11.63) 0,10.73
Stack: Top Layer 0.035mm 外层铜厚1oz / Dielectric1 0.2104mm 7628 RC49% 8.6mil / Inner1 0.0152mm 内层铜厚 / Dielectric2 1.065mm 1.1mm H/HOZ Copper / Inner2 0.0152mm 内层铜厚 / Dielectric3 0.2104mm 7628 RC49% 8.6mil / Bottom Layer 0.035mm 外层铜厚1oz

## Design rules (mm)
template: MoonGrt
spacing Default (default): track to track 0.102, other pairs 0 to 0.102
track width Default (default): min 0.102, default 0.203, max 25.4
track width PWR: min 0.102, default 0.508, max 2.54
differential pair differentialPair (default): width min 0.127, default 0.254, max 2.54; gap min 0.152, default 0.152
via Default (default): diameter min 0.508, default 0.508, max 100.025; hole min 0.305, default 0.305, max 59.995
net GND uses PWR
net 5V uses PWR
net 3.3V uses PWR
net VBUS uses PWR

## Placement (name value [footprint] x y rotation side)
C1  22pF  [C0603]  19.1 6 90 bottom
C2  22pF  [C0603]  14.07 6 90 bottom
C3  10uF  [C0603]  9.14 3.08 180 top
C4  10uF  [C0603]  9.14 8.92 0 top
C5  100nF  [C0603]  15.6 11.06 180 bottom
C6  10uF  [C0603]  10.47 0.92 0 top
C7  10uF  [C0603]  18.92 11.06 180 bottom
C8  10uF  [C0603]  10.47 11.06 0 top
C9  10uF  [C0603]  18.92 0.92 180 bottom
CN1  HDGC1006WR-S-6P  [CONN-SMD_6P-P1.00_HDGC1006WR-S-6P]  24.82 6 270 bottom
F1  BSMD0805-100-6V  [F0805]  9.14 6 270 top
H1  -  [MoonGrt]  2.41 6 90 top
LED1  LTST-C193TBKT-5A  [LED0603]  25.53 0.92 0 top
LED2  LTST-C193TBKT-5A  [LED0603]  22.23 0.92 180 top
LED3  LTST-C193TBKT-5A  [LED0603]  25.53 11.05 0 top
LED4  LTST-C193TBKT-5A  [LED0603]  22.23 11.06 180 top
Q1  MMBT3904  [SOT-23-3_L2.9-W1.3-P1.90-LS2.4-BR]  3 3.21 90 bottom
R1  4.7kΩ  [R0603]  20.68 4.35 270 bottom
R2  10kΩ  [R0603]  20.68 7.65 90 bottom
R3  10kΩ  [R0603]  12.24 11.06 0 bottom
R4  10kΩ  [R0603]  12.24 0.92 0 bottom
R5  10kΩ  [R0603]  15.6 0.92 0 bottom
R6  10kΩ  [R0603]  12.52 4.35 270 bottom
R7  10kΩ  [R0603]  12.52 7.65 90 bottom
R8  100Ω  [R0603]  16.59 5.11 180 bottom
R9  1kΩ  [R0603]  25.53 0.92 0 bottom
R10  10kΩ  [R0603]  2.79 8.79 180 bottom
R11  22Ω  [R0603]  6.73 4.35 90 bottom
R12  22Ω  [R0603]  6.73 7.65 270 bottom
R13  100Ω  [R0603]  2.79 7.27 0 bottom
R14  1kΩ  [R0603]  22.23 0.92 180 bottom
R15  36kΩ  [R0603]  2.79 5.75 0 bottom
R16  1.5kΩ  [R0603]  5.21 6 90 bottom
R17  1kΩ  [R0603]  25.53 11.06 0 bottom
R18  1kΩ  [R0603]  22.22 11.06 180 bottom
U1  662K  [SOT-23-3_L2.9-W1.3-P1.90-LS2.4-BR]  9.27 6 0 bottom
U2  STM32F103C8T6  [LQFP-48_L7.0-W7.0-P0.50-LS9.0-BL]  16.59 6 180 top
U3  CAS-D20TB1  [SW-SMD_L5.4-W3.9_CAS-D20B]  25.2 6 0 top
USBC1  TYPE-C-31-M-12  [USB-C_SMD-TYPE-C-31-M-12]  3.94 6 270 top
X1  8MHz  [OSC-SMD_3P-L3.2-W1.3-P1.20-L]  16.59 6.89 0 bottom

## Footprints (pads in the part's own frame, mm; a bottom-side part is the same pattern mirrored in y, then rotated)
C0603
  rect 0.8x0.9 smd: 1(-0.889,0) 2(0.889,0)
CONN-SMD_6P-P1.00_HDGC1006WR-S-6P
  rect 0.6x1.25 smd: 1(-2.5,1.562) 2(-1.5,1.562) 3(-0.5,1.562) 4(0.5,1.562) 5(1.5,1.562) 6(2.5,1.562)
  rect 1x1.7 smd: 7(3.95,-1.562) 8(-3.95,-1.562)
F0805
  rect 1.335x1.5 smd: 1(-1.143,0) 2(1.143,0)
LED0603
  rect 0.8x0.9 smd: 1(-0.889,0) 2(0.888,0)
LQFP-48_L7.0-W7.0-P0.50-LS9.0-BL
  oval 0.27x1.5 smd: 1(-2.75,-4.25) 2(-2.25,-4.25) 3(-1.75,-4.25) 4(-1.25,-4.25) 5(-0.75,-4.25) 6(-0.25,-4.25) 7(0.25,-4.25) 8(0.75,-4.25) 9(1.25,-4.25) 10(1.75,-4.25) 11(2.25,-4.25) 12(2.75,-4.25) 25(2.75,4.25) 26(2.25,4.25) 27(1.75,4.25) 28(1.25,4.25) 29(0.75,4.25) 30(0.25,4.25) 31(-0.25,4.25) 32(-0.75,4.25) 33(-1.25,4.25) 34(-1.75,4.25) 35(-2.25,4.25) 36(-2.75,4.25)
  oval 1.5x0.27 smd: 13(4.25,-2.75) 14(4.25,-2.25) 15(4.25,-1.75) 16(4.25,-1.25) 17(4.25,-0.75) 18(4.25,-0.25) 19(4.25,0.25) 20(4.25,0.75) 21(4.25,1.25) 22(4.25,1.75) 23(4.25,2.25) 24(4.25,2.75) 37(-4.25,2.75) 38(-4.25,2.25) 39(-4.25,1.75) 40(-4.25,1.25) 41(-4.25,0.75) 42(-4.25,0.25) 43(-4.25,-0.25) 44(-4.25,-0.75) 45(-4.25,-1.25) 46(-4.25,-1.75) 47(-4.25,-2.25) 48(-4.25,-2.75)
OSC-SMD_3P-L3.2-W1.3-P1.20-L
  rect 0.6x1.4 smd: 1(-1.199,0) 2(0,0) 3(1.199,0)
R0603
  rect 0.8x0.9 smd: 1(-0.889,0) 2(0.889,0)
SOT-23-3_L2.9-W1.3-P1.90-LS2.4-BR
  rect 1.25x0.7 smd: 1(1,-0.95) 2(1,0.95) 3(-1,0)
SW-SMD_L5.4-W3.9_CAS-D20B
  rect 1x1.3 smd: 1(-1.75,-2.6) 2(0,-2.6) 3(1.75,-2.6) 4(1.75,2.6) 5(0,2.6) 6(-1.75,2.6)
USB-C_SMD-TYPE-C-31-M-12
  oval 1.2x2 hole 0.8x1.6: 1(4.32,1.556) 4(-4.32,1.556)
  oval 1.2x1.8 hole 0.8x1.4: 2(4.32,-2.624) 3(-4.32,-2.624)
  rect 0.3x1.3 smd: A1(-3.35,2.623) A4(-2.55,2.623) A5(-1.25,2.623) A6(-0.25,2.623) A7(0.25,2.623) A8(1.25,2.624) A9(2.55,2.623) A12(3.35,2.623) B1(3.05,2.623) B4(2.25,2.623) B5(1.75,2.623) B6(0.75,2.623) B7(-0.75,2.623) B8(-1.75,2.624) B9(-2.25,2.623) B12(-3.05,2.623)

## Nets
As in the schematic.

Pads without a net: U2 4 11 14 16 17 18 19 21 22 28 29 31 40 41 42 43 45 46; USBC1 A5 A8 B5 B8

## Via types
v1: diameter 0.508, hole 0.305, Top Layer to Bottom Layer, 71 vias

## Routing (per net, layer and track width the routed paths; a pad name or vN(x,y) marks a point on that pad's centre or on a via; arc(x,y) is an arc through that point)
3.3V: length 3.7
  Bottom Layer w0.508: v1(20.68,2.75) R1.2 ; 26.42,11.06 v1(27.17,11.06) ; R14.2 v1(22.09,0.92) ; v1(20.58,11.06) R18.2 ; 26.42,0.92 v1(27.17,0.92)
  vias: v1(3,2.21) v1(10.27,5.05) v1(11.35,11.06) v1(11.35,0.92) v1(18.1,11.3) v1(18.09,0.71) v1(23.25,6.5)
5V: length 6.3
  Bottom Layer w0.508: U1.3 8.27,7.01 7.55,7.73 4.8,7.73 3.73,8.79 R10.1
  vias: v1(8.25,6) v1(8.25,5.27) v1(8.25,4.54) v1(8.25,3.81) v1(8.25,3.08) v1(9.14,5.99) v1(9.14,5.26) v1(9.14,4.53) v1(9.14,3.8) v1(9.14,3.07)
GND: length 8.9
  Top Layer w0.254: 12.34,5.25 13.93,5.25 v1(14.07,5.11) 14.07,4.63 13.19,3.75 12.34,3.75 ; v1(19.81,8.24) 19.83,8.25 U2.47 ; U2.8 15.84,11.19 15.95,11.31 v1(16.56,11.31) ; v1(18.84,0.72) 18.84,1.75
  Top Layer w0.508: v1(25.66,0.89) 26.39,0.89 LED1.2
  vias: v1(8.25,8.92) v1(9.58,11.06) v1(9.58,0.92) v1(10.03,3.08)
AIN: length 11.6
  Top Layer w0.203: U2.10 14.84,9.3 v1(14.83,9.29)
  Inner2 w0.203: v1(14.83,9.29) 14.83,2.58 13.16,0.92 v1(13.13,0.92)
  Bottom Layer w0.203: v1(13.13,0.92) R5.1
CLK: length 21.1
  Top Layer w0.203: v1(14.33,2.73) 14.34,2.73 14.34,1.75 ; v1(13.29,7.74) 12.94,7.74 12.93,7.75 12.34,7.75
  Inner1 w0.203: v1(26.95,3.4) 25.33,1.78 15.28,1.78 v1(14.33,2.73)
  Inner2 w0.203: v1(14.33,2.73) 14.33,3.29 13.29,4.33 v1(13.29,7.74)
DIO: length 12
  Top Layer w0.203: U2.27 14.84,2.45 v1(17.48,5.09) ; v1(22.27,8.62) 23.43,8.62 U3.6
  Inner1 w0.203: v1(22.27,8.62) 20.36,6.71 20.36,6.57 20.1,6.31 20.06,6.31 18.84,5.09 v1(17.48,5.09)
  Bottom Layer w0.203: R8.1 v1(17.48,5.09)
LED: length 7.1
  Top Layer w0.203: v1(20.58,0.89) 21.31,0.89 21.34,0.92 ; 16.34,1.75 16.34,2.7 v1(16.36,2.72)
  Inner2 w0.203: v1(16.36,2.72) 16.36,2.14 16.71,1.78 19.69,1.78 v1(20.58,0.89)
OSC_IN: length 4.9
  Top Layer w0.203: 17.34,10.25 17.34,8.26 v1(17.78,7.82)
  Bottom Layer w0.203: v1(17.78,7.82) 17.78,7.81 X1.3 17.82,6.92 19.06,6.92 19.1,6.89
OSC_OUT: length 5.9
  Top Layer w0.203: U2.6 16.84,8.23 16.45,7.84 v1(15.39,7.84)
  Bottom Layer w0.203: v1(15.39,7.84) X1.1 14.07,6.89
RESET: length 5
  Top Layer w0.203: 16.34,10.25 16.34,9.29 v1(16.33,9.28)
  Bottom Layer w0.203: R3.2 C5.2 16.33,9.43 v1(16.33,9.28)
RX: length 25
  Top Layer w0.203: LED3.2 26.41,11.06 v1(25.66,11.06) ; v1(13.33,8.77) 13.31,8.75 12.34,8.75
  Inner1 w0.203: v1(13.33,8.77) 13.33,9.42 14.21,10.29 20.68,10.29 21.9,11.51 25.21,11.51 v1(25.66,11.06) 25.66,4.85 v1(24.31,3.5)
  Bottom Layer w0.203: CN1.6 v1(24.31,3.5)
SWCLK: length 2.7
  Top Layer w0.203: U2.37 23.3,3.25 U3.1
SWDIO: length 14.9
  Top Layer w0.203: 18.34,1.75 v1(18.34,2.71)
  Inner1 w0.203: v1(18.34,2.71) 18.75,2.29 25.02,2.29 26.95,4.22 v1(26.95,8.6)
TX: length 17.8
  Top Layer w0.203: v1(13.84,9.28) U2.12 ; LED4.2 v1(22.09,11.06)
  Inner1 w0.203: v1(13.84,9.28) 14.55,9.99 21.06,9.99 22.09,11.02 v1(22.09,11.06) 22.8,10.35 22.8,4.96 v1(23.25,4.5)
USB_DM: length 3.4
  Top Layer w0.203: USBC1.B6 v1(7.47,5.25) 7.47,6.05 7.27,6.25 USBC1.A6
  Bottom Layer w0.203: v1(7.47,5.25) 6.74,5.25 R11.2
USB_DP: length 5.6
  Top Layer w0.203: USBC1.A7 5.97,5.75 5.71,6.02 5.71,6.48 5.97,6.75 USBC1.B7 7.47,6.75 v1(7.47,6.75)
  Bottom Layer w0.203: R16.2 5.33,6.76 R12.2 ; 6.73,6.77 6.75,6.75 v1(7.47,6.75)
USB_M: length 13
  Top Layer w0.203: 17.34,1.75 17.34,2.7 v1(17.34,2.71)
  Inner1 w0.203: v1(11.23,3.26) 11.53,3.56 16.5,3.56 v1(17.34,2.71)
  Bottom Layer w0.203: R11.1 7.94,2.25 10.22,2.25 v1(11.23,3.26)
USB_P: length 17.2
  Top Layer w0.203: v1(17.84,3.08) 17.84,3.07 U2.33
  Inner1 w0.203: v1(17.84,3.08) 17.06,3.86 11.51,3.86 v1(11.23,4.15)
  Inner2 w0.203: v1(11.23,8.44) v1(11.23,4.15)
  Bottom Layer w0.203: v1(11.23,8.44) 11.22,8.43 6.84,8.43 R12.1
USB_RENU: length 18.6
  Top Layer w0.203: v1(19.83,3.75) U2.38
  Inner1 w0.203: v1(19.83,3.75) 18.1,3.75 17.69,4.17 11.85,4.17 8.75,7.27 v1(3.68,7.27)
$2N32655: length 10.3
  Top Layer w0.203: v1(18.83,8.93) 18.84,8.93 U2.2
  Bottom Layer w0.127: R6.1 13.01,5.73 17,5.73 17.28,6.01 17.28,7.92 18.17,8.8 18.44,8.8 18.56,8.93 v1(18.83,8.93)
$2N32685: length 2
  Bottom Layer w0.203: R16.1 5.21,4.55 4.86,4.21 Q1.2
$2N32778: length 4.1
  Top Layer w0.203: U2.25 13.84,3.09 v1(13.83,3.1)
  Bottom Layer w0.203: R8.2 13.83,3.25 v1(13.83,3.1)
$2N32789: length 5.3
  Bottom Layer w0.203: CN1.2 24.48,7.5 25.16,6.83 25.16,3.67
  vias: v1(25.2,3.4)
$2N32791: length 2
  Bottom Layer w0.203: CN1.1 25.1,8.5 v1(25.2,8.6)
$2N32800: length 0.8
  Bottom Layer w0.203: v1(19.91,6.76) R2.1
$2N32802: length 2.5
  Top Layer w0.203: U2.39 21.61,4.25 21.62,4.26 v1(21.79,4.26)
  Bottom Layer w0.203: R1.1 20.81,5.24 v1(21.79,4.26)
$2N32803: length 9.6
  Top Layer w0.203: 18.34,10.25 18.34,10.25 v1(18.34,9.3)
  Bottom Layer w0.127: R7.1 13.33,5.96 16.89,5.96 17.05,6.12 17.05,8.01 v1(18.34,9.3)
$2N32831: length 4.6
  Bottom Layer w0.203: 1.9,5.6 1.9,5.6 1.9,7.12 1.9,8.64 ; R15.1 1.91,4.35 Q1.1
$2N38015:
  vias: v1(24.64,0.92)
$2N38044:
  vias: v1(23.11,0.92)
$2N38073:
  vias: v1(24.64,11.05)
$2N38102:
  vias: v1(23.12,11.06)

## Copper pours and planes (outline as drawn; the poured copper is in the pictures)
3.3V on Top Layer: 0,12 28,12 28,0 0,0
5V on Top Layer: 7.65,6.35 9.9,6.35 9.9,2.63 7.65,2.63
5V on Bottom Layer: 7.65,6.35 9.9,6.35 9.9,2.63 7.65,2.63
GND on Top Layer: 4.49,3.1 7.21,3.1 7.21,1.08 4.49,1.08
GND on Top Layer: 4.49,10.92 7.21,10.92 7.21,8.9 4.49,8.9
GND on Bottom Layer: 0,12 28,12 28,0 0,0
VBUS on Top Layer: 4.58,8.4 5.9,8.4 5.9,3.6 4.58,3.6
VBUS on Top Layer: 4.58,8.8 7.2,8.8 7.2,7.9 4.58,7.9
VBUS on Top Layer: 4.58,4.1 7.2,4.1 7.2,3.2 4.58,3.2
VBUS on Top Layer: 6.55,8.8 8.65,8.8 8.65,6.48 6.55,6.48
VBUS on Top Layer: 8.38,8.38 9.9,8.38 9.9,6.48 8.38,6.48

# Board ST-Link_v1_2
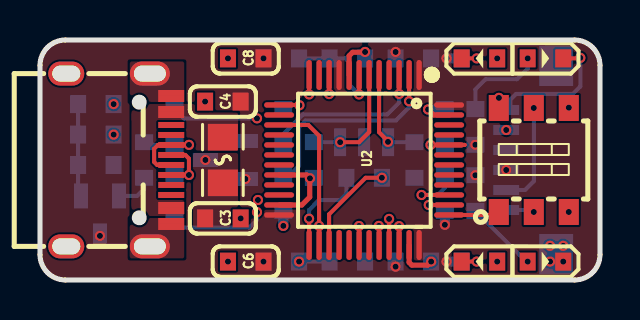
[diagram p4: board, top side]
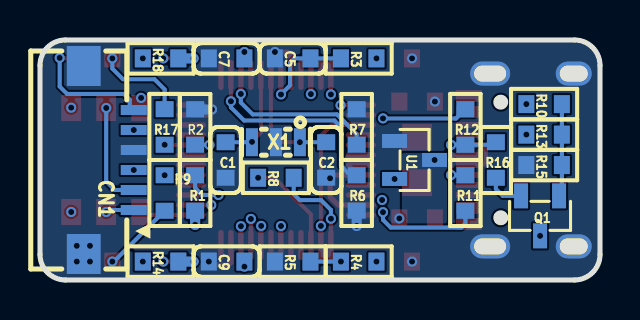
[diagram p5: board, bottom side, seen from below]

Outline 28 x 12 mm; copper layers: Top Layer, Inner1, Inner2, Bottom Layer. Coordinates in mm from the lower left corner of the outline.
Outline path: 0,10.73 0,1.27 arc(0.37,0.37) 1.27,0 26.73,0 arc(27.63,0.37) 28,1.27 28,10.73 arc(27.63,11.63) 26.73,12 1.27,12 arc(0.37,11.63) 0,10.73
Stack: Top Layer 0.035mm 外层铜厚1oz / Dielectric1 0.2104mm 7628 RC49% 8.6mil / Inner1 0.0152mm 内层铜厚 / Dielectric2 1.065mm 1.1mm H/HOZ Copper / Inner2 0.0152mm 内层铜厚 / Dielectric3 0.2104mm 7628 RC49% 8.6mil / Bottom Layer 0.035mm 外层铜厚1oz

## Design rules (mm)
template: MoonGrt
spacing Default (default): track to track 0.102, other pairs 0 to 0.102
track width Default (default): min 0.102, default 0.203, max 25.4
track width PWR: min 0.102, default 0.508, max 2.54
differential pair differentialPair (default): width min 0.127, default 0.254, max 2.54; gap min 0.152, default 0.152
via Default (default): diameter min 0.508, default 0.508, max 100.025; hole min 0.305, default 0.305, max 59.995
net GND uses PWR
net 5V uses PWR
net 3.3V uses PWR
net VBUS uses PWR

## Placement (name value [footprint] x y rotation side)
C1  22pF  [C0603]  18.72 6 90 bottom
C2  22pF  [C0603]  13.69 6 90 bottom
C3  10uF  [C0603]  9.14 3.08 180 top
C4  10uF  [C0603]  9.14 8.92 0 top
C5  100nF  [C0603]  15.37 11.08 180 bottom
C6  10uF  [C0603]  10.29 0.92 0 top
C7  10uF  [C0603]  18.67 11.08 180 bottom
C8  10uF  [C0603]  10.29 11.08 0 top
C9  10uF  [C0603]  18.67 0.92 180 bottom
CN1  FPC09-Q1.0-6AH2.0  [FPC-SMD_6P-P1.00_XYECONN_FPC09-Q1.0-6AH2.0]  24.51 6 90 bottom
F1  BSMD0805-100-6V  [F0805]  9.14 6 270 top
H1  -  [MoonGrt]  2.41 6 90 top
LED1  LTST-C193TBKT-5A  [LED0603]  25.27 0.92 0 top
LED2  LTST-C193TBKT-5A  [LED0603]  21.97 0.92 180 top
LED3  LTST-C193TBKT-5A  [LED0603]  25.27 11.08 0 top
LED4  LTST-C193TBKT-5A  [LED0603]  21.97 11.08 180 top
Q1  MMBT3904  [SOT-23-3_L2.9-W1.3-P1.90-LS2.4-BR]  3 3.21 90 bottom
R1  4.7kΩ  [R0603]  20.24 4.35 270 bottom
R2  10kΩ  [R0603]  20.24 7.65 90 bottom
R3  10kΩ  [R0603]  12.06 11.08 0 bottom
R4  10kΩ  [R0603]  12.06 0.92 0 bottom
R5  10kΩ  [R0603]  15.37 0.92 0 bottom
R6  10kΩ  [R0603]  12.17 4.35 270 bottom
R7  10kΩ  [R0603]  12.17 7.65 90 bottom
R8  100Ω  [R0603]  16.21 5.11 180 bottom
R9  1kΩ  [R0603]  21.77 4.35 90 bottom
R10  10kΩ  [R0603]  2.79 8.79 180 bottom
R11  22Ω  [R0603]  6.73 4.35 90 bottom
R12  22Ω  [R0603]  6.73 7.65 270 bottom
R13  100Ω  [R0603]  2.79 7.27 0 bottom
R14  1kΩ  [R0603]  21.97 0.92 180 bottom
R15  36kΩ  [R0603]  2.79 5.75 0 bottom
R16  1.5kΩ  [R0603]  5.21 6 90 bottom
R17  1kΩ  [R0603]  21.77 7.65 270 bottom
R18  1kΩ  [R0603]  21.97 11.08 180 bottom
U1  662K  [SOT-23-3_L2.9-W1.3-P1.90-LS2.4-BR]  9.27 6 0 bottom
U2  STM32F103C8T6  [LQFP-48_L7.0-W7.0-P0.50-LS9.0-BL]  16.21 6 180 top
U3  CAS-D20TB1  [SW-SMD_L5.4-W3.9_CAS-D20B]  24.69 6 0 top
USBC1  TYPE-C-31-M-12  [USB-C_SMD-TYPE-C-31-M-12]  3.94 6 270 top
X1  8MHz  [OSC-SMD_3P-L3.2-W1.3-P1.20-L]  16.21 6.89 0 bottom

## Footprints (pads in the part's own frame, mm; a bottom-side part is the same pattern mirrored in y, then rotated)
C0603
  rect 0.8x0.9 smd: 1(-0.889,0) 2(0.889,0)
F0805
  rect 1.335x1.5 smd: 1(-1.143,0) 2(1.143,0)
FPC-SMD_6P-P1.00_XYECONN_FPC09-Q1.0-6AH2.0
  rect 0.5x1.3 smd: 1(-2.5,-1.2) 2(-1.5,-1.2) 3(-0.5,-1.2) 4(0.5,-1.2) 5(1.5,-1.2) 6(2.5,-1.2)
  rect 2x1.7 smd: 7(4.7,1.3) 8(-4.7,1.3)
LED0603
  rect 0.8x0.9 smd: 1(-0.889,0) 2(0.888,0)
LQFP-48_L7.0-W7.0-P0.50-LS9.0-BL
  oval 0.27x1.5 smd: 1(-2.75,-4.25) 2(-2.25,-4.25) 3(-1.75,-4.25) 4(-1.25,-4.25) 5(-0.75,-4.25) 6(-0.25,-4.25) 7(0.25,-4.25) 8(0.75,-4.25) 9(1.25,-4.25) 10(1.75,-4.25) 11(2.25,-4.25) 12(2.75,-4.25) 25(2.75,4.25) 26(2.25,4.25) 27(1.75,4.25) 28(1.25,4.25) 29(0.75,4.25) 30(0.25,4.25) 31(-0.25,4.25) 32(-0.75,4.25) 33(-1.25,4.25) 34(-1.75,4.25) 35(-2.25,4.25) 36(-2.75,4.25)
  oval 1.5x0.27 smd: 13(4.25,-2.75) 14(4.25,-2.25) 15(4.25,-1.75) 16(4.25,-1.25) 17(4.25,-0.75) 18(4.25,-0.25) 19(4.25,0.25) 20(4.25,0.75) 21(4.25,1.25) 22(4.25,1.75) 23(4.25,2.25) 24(4.25,2.75) 37(-4.25,2.75) 38(-4.25,2.25) 39(-4.25,1.75) 40(-4.25,1.25) 41(-4.25,0.75) 42(-4.25,0.25) 43(-4.25,-0.25) 44(-4.25,-0.75) 45(-4.25,-1.25) 46(-4.25,-1.75) 47(-4.25,-2.25) 48(-4.25,-2.75)
OSC-SMD_3P-L3.2-W1.3-P1.20-L
  rect 0.6x1.4 smd: 1(-1.199,0) 2(0,0) 3(1.199,0)
R0603
  rect 0.8x0.9 smd: 1(-0.889,0) 2(0.889,0)
SOT-23-3_L2.9-W1.3-P1.90-LS2.4-BR
  rect 1.25x0.7 smd: 1(1,-0.95) 2(1,0.95) 3(-1,0)
SW-SMD_L5.4-W3.9_CAS-D20B
  rect 1x1.3 smd: 1(-1.75,-2.6) 2(0,-2.6) 3(1.75,-2.6) 4(1.75,2.6) 5(0,2.6) 6(-1.75,2.6)
USB-C_SMD-TYPE-C-31-M-12
  oval 1.2x2 hole 0.8x1.6: 1(4.32,1.556) 4(-4.32,1.556)
  oval 1.2x1.8 hole 0.8x1.4: 2(4.32,-2.624) 3(-4.32,-2.624)
  rect 0.3x1.3 smd: A1(-3.35,2.623) A4(-2.55,2.623) A5(-1.25,2.623) A6(-0.25,2.623) A7(0.25,2.623) A8(1.25,2.624) A9(2.55,2.623) A12(3.35,2.623) B1(3.05,2.623) B4(2.25,2.623) B5(1.75,2.623) B6(0.75,2.623) B7(-0.75,2.623) B8(-1.75,2.624) B9(-2.25,2.623) B12(-3.05,2.623)

## Nets
As in the schematic.

Pads without a net: U2 4 11 14 16 17 18 19 21 22 28 29 31 40 41 42 43 45 46; USBC1 A5 A8 B5 B8

## Via types
v1: diameter 0.508, hole 0.305, Top Layer to Bottom Layer, 65 vias

## Routing (per net, layer and track width the routed paths; a pad name or vN(x,y) marks a point on that pad's centre or on a via; arc(x,y) is an arc through that point)
3.3V: length 2.2
  Bottom Layer w0.508: R1.2 v1(20.24,2.76) ; 21.08,0.92 v1(20.33,0.92) ; 21.08,11.08 v1(20.33,11.08)
  vias: v1(3,2.21) v1(10.27,5.05) v1(11.18,11.08) v1(11.18,0.92) v1(17.78,11.4) v1(17.78,0.67) v1(21.77,6.76) v1(21.77,5.24) v1(23.31,5.5)
5V: length 6.3
  Inner1 w0.762: v1(3.68,8.79) 4.9,7.58 7.67,7.58 8.27,6.98 v1(8.27,6)
GND: length 11
  Top Layer w0.254: v1(16.25,11.4) 16.24,11.39 15.63,11.39 15.46,11.21 U2.8 ; v1(19.56,0.92) 19.38,0.74 18.59,0.74 18.46,0.88 U2.35 ; v1(19.4,8.53) 19.68,8.25 U2.47 ; U2.20 13.33,5.25 v1(13.5,5.09) 13.49,5.08 13.49,4.15 13.09,3.75 U2.23
  Bottom Layer w0.508: R2.2 20.23,8.53 v1(19.4,8.53) ; R6.2 v1(12.17,2.7)
  vias: v1(8.25,8.92) v1(9.4,11.08) v1(9.4,0.92) v1(10.03,3.08) v1(25.5,1.71) v1(25.5,0.92) v1(26.16,1.71) v1(26.16,0.92)
AIN: length 11.5
  Top Layer w0.203: v1(14.46,9.3) U2.10
  Inner2 w0.203: v1(14.46,9.3) 14.46,2.42 v1(12.95,0.92)
  Bottom Layer w0.203: v1(12.95,0.92) R5.1
CLK: length 21.1
  Top Layer w0.203: U2.15 13.41,7.75 13.96,7.21 v1(13.96,2.7) U2.26
  Inner1 w0.203: v1(26.44,3.4) 26.38,3.4 24.87,1.89 14.77,1.89 v1(13.96,2.7)
DIO: length 12.4
  Top Layer w0.203: v1(17.09,5.11) 16.28,5.11 14.46,3.28 U2.27
  Inner1 w0.203: v1(17.09,5.11) 17.98,6 19.84,6 v1(22.95,9.11)
LED: length 8.8
  Top Layer w0.203: LED2.2 v1(21.84,0.92) ; U2.30 15.96,2.69 v1(15.95,2.7)
  Inner2 w0.203: v1(15.95,2.7) 15.95,1.81 16.26,1.5 21.25,1.5 v1(21.84,0.92)
OSC_IN: length 4.8
  Top Layer w0.203: U2.5 16.96,7.39 17.4,6.94 v1(17.4,6.91)
  Bottom Layer w0.203: 17.4,6.89 C1.2
OSC_OUT: length 5.8
  Top Layer w0.203: U2.6 16.46,10.25 16.46,7.4 15.95,6.89 v1(15.01,6.89)
  Bottom Layer w0.203: C2.2 v1(15.01,6.89)
RESET: length 5.4
  Top Layer w0.203: U2.7 15.96,9.28 v1(15.95,9.28)
  Bottom Layer w0.203: v1(15.95,9.28) 15.49,9.73 15.49,10.85 15.27,11.08 C5.2 R3.2
RX: length 23
  Top Layer w0.203: v1(12.97,8.74) 12.96,8.75 U2.13 ; LED3.2 26.99,11.08 v1(27.02,11.11)
  Inner1 w0.203: v1(12.97,8.74) 13.68,8.74 13.91,8.97 13.91,9.4 14.39,9.88 25.79,9.88 v1(27.02,11.11)
  Bottom Layer w0.203: v1(27.02,11.11) 27.02,9.67 26.64,9.3 23.8,9.3 23.51,9.02 23.51,8.7 CN1.6
SWCLK: length 2.5
  Top Layer w0.203: U3.1 22.79,3.25 U2.37
SWDIO: length 14.9
  Top Layer w0.203: 17.95,1.75 v1(17.95,2.69)
  Inner1 w0.203: v1(26.44,8.62) 26.44,4.05 24.68,2.29 18.35,2.29 v1(17.95,2.69)
TX: length 15.2
  Top Layer w0.203: LED4.2 v1(21.84,11.08) ; v1(13.46,9.28) U2.12
  Inner1 w0.203: v1(21.84,11.08) 21.06,10.3 14.19,10.3 13.46,9.57 v1(13.46,9.28)
  Inner2 w0.203: v1(21.84,11.08) 21.84,8.97 v1(23.31,7.5)
USB_DM: length 3.4
  Top Layer w0.203: USBC1.B6 v1(7.45,5.25) 7.45,6.07 7.27,6.25 USBC1.A6
  Bottom Layer w0.203: v1(7.45,5.25) 6.74,5.25 R11.2
USB_DP: length 5.7
  Top Layer w0.203: 6.57,6.76 v1(7.45,6.76) ; USBC1.B7 5.9,6.75 5.71,6.56 5.71,5.9 5.86,5.75 USBC1.A7
  Bottom Layer w0.203: v1(7.45,6.76) 7.44,6.76 R12.2 5.33,6.76 R16.2
USB_M: length 12.8
  Top Layer w0.203: U2.32 16.96,2.69 v1(16.94,2.7)
  Inner1 w0.203: v1(10.85,3.39) 11,3.54 16.1,3.54 v1(16.94,2.7)
  Bottom Layer w0.203: v1(10.85,3.39) 10.85,3.01 10.47,2.62 6.93,2.62 6.73,2.83 R11.1
USB_P: length 16.7
  Top Layer w0.203: v1(17.46,3.05) U2.33
  Inner1 w0.203: v1(17.45,3.05) 17.45,3.18 16.63,4 v1(10.9,4)
  Inner2 w0.203: v1(10.9,4) 10.85,4.05 v1(10.85,8.08)
  Bottom Layer w0.203: R12.1 7.2,8.08 10.84,8.08 v1(10.85,8.08)
USB_RENU: length 18.9
  Top Layer w0.203: 19.44,3.75 U2.38
  Inner1 w0.203: v1(19.44,3.75) 17.82,3.75 17.11,4.46 5.35,4.46 3.68,6.13 v1(3.68,7.27)
$2N32655: length 10.5
  Top Layer w0.203: 18.46,8.94 U2.2
  Bottom Layer w0.203: v1(18.45,8.94) 18.45,8.63 17.8,7.98 13.28,7.98 12.95,7.65 12.95,5.71 12.61,5.36 12.29,5.36 R6.1
$2N32685: length 2
  Bottom Layer w0.203: Q1.2 4.86,4.21 5.21,4.55 R16.1
$2N32778: length 4.8
  Top Layer w0.203: U2.25 13.46,3.06 v1(13.45,3.06)
  Bottom Layer w0.203: v1(13.45,3.06) 13.45,3.5 13.94,3.99 15.01,3.99 15.32,4.3 R8.2
$2N32789: length 5.2
  Bottom Layer w0.203: v1(24.69,8.6) 24.69,4.93 24.25,4.5 CN1.2
$2N32791: length 1.4
  Bottom Layer w0.203: v1(24.69,3.4) 24.59,3.5 CN1.1
$2N32800: length 3.2
  Top Layer w0.203: v1(19.53,6.75) 21.23,6.75 21.23,6.75 U2.44
  Bottom Layer w0.203: v1(19.53,6.75) 20.23,6.75 R2.1
$2N32802: length 3.3
  Top Layer w0.203: v1(19.08,4.25) U2.39
  Bottom Layer w0.203: v1(19.08,4.25) 19.89,4.25 20.24,4.6 R1.1
$2N32803: length 7.4
  Bottom Layer w0.203: R7.1 12.17,7.3 13.15,8.28 17.36,8.28 17.96,8.87 v1(17.96,9.3)
$2N32831: length 4.6
  Bottom Layer w0.203: R10.2 R13.1 R15.1 1.91,4.35 Q1.1
$2N38015: length 3.7
  Bottom Layer w0.203: R9.1 24.31,0.92 v1(24.38,0.92)
$2N38044:
  vias: v1(22.86,0.92)
$2N38073: length 4.5
  Bottom Layer w0.203: R17.1 21.77,9.53 22.28,10.04 23.85,10.04 24.38,10.57 v1(24.38,11.08)
$2N38102:
  vias: v1(22.86,11.08)

## Copper pours and planes (outline as drawn; the poured copper is in the pictures)
3.3V on Top Layer: 0,12 28,12 28,0 0,0
5V on Top Layer: 7.65,6.35 9.9,6.35 9.9,2.63 7.65,2.63
5V on Bottom Layer: 7.65,6.35 9.9,6.35 9.9,2.63 7.65,2.63
GND on Top Layer: 4.49,10.92 7.21,10.92 7.21,8.9 4.49,8.9
GND on Top Layer: 4.49,3.1 7.21,3.1 7.21,1.08 4.49,1.08
GND on Bottom Layer: 0.08,12 28.08,12 28.08,0 0.08,0
VBUS on Top Layer: 6.55,8.8 8.65,8.8 8.65,6.48 6.55,6.48
VBUS on Top Layer: 4.58,4.1 7.2,4.1 7.2,3.2 4.58,3.2
VBUS on Top Layer: 8.38,8.38 9.9,8.38 9.9,6.48 8.38,6.48
VBUS on Top Layer: 4.58,8.4 5.9,8.4 5.9,3.6 4.58,3.6
VBUS on Top Layer: 4.58,8.8 7.2,8.8 7.2,7.9 4.58,7.9
